# Altium project serdes-interface.PrjPcb
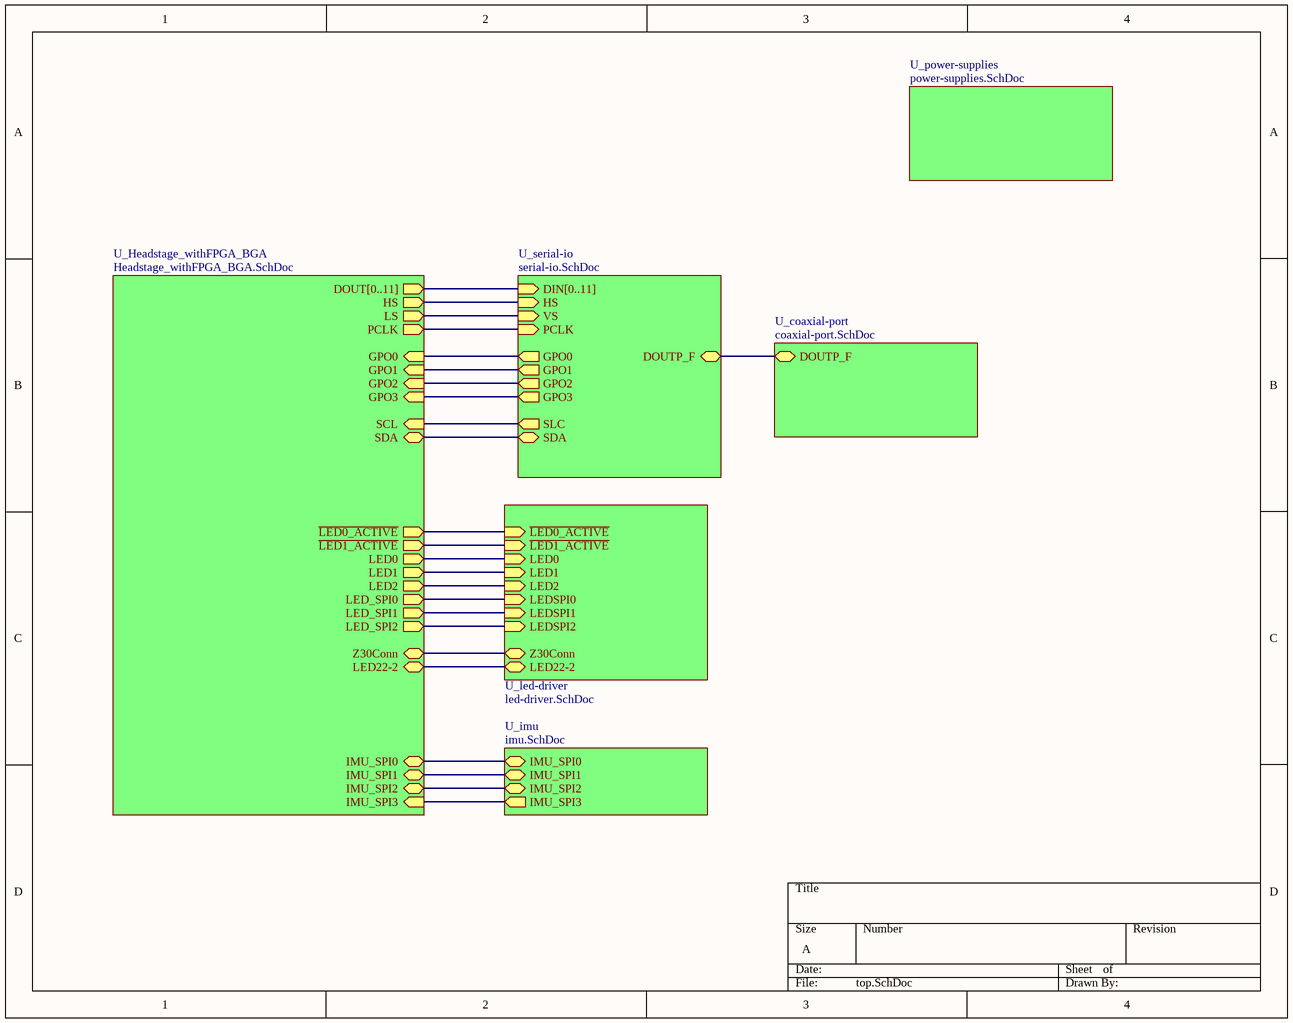
[diagram p0: top.SchDoc]
6 sheets, 71 parts. Net scope: hierarchical (ports join the sheet entries above them; power ports are global).
Board file: serdes-interface.PcbDoc
Sheets:
  top.SchDoc
    U_coaxial-port = coaxial-port.SchDoc
    U_power-supplies = power-supplies.SchDoc
    U_serial-io = serial-io.SchDoc
    U_led-driver = led-driver.SchDoc
    U_imu = imu.SchDoc

## Sheet top.SchDoc
size A

### Sub-sheets
U_coaxial-port = coaxial-port.SchDoc: DOUTP_F (bidir)
U_Headstage_withFPGA_BGA = Headstage_withFPGA_BGA.SchDoc (file not in this document): DOUT[0..11] (out), HS (out), LS (out), PCLK (out), GPO3 (in), GPO2 (in), GPO1 (in), SDA (bidir), SCL (in), GPO0 (in), ~{LED0_ACTIVE} (out), ~{LED1_ACTIVE} (out), LED0 (out), LED1 (out), LED2 (out), LED_SPI0 (out), LED_SPI1 (out), LED_SPI2 (out), Z30Conn (bidir), IMU_SPI0 (bidir), IMU_SPI1 (bidir), IMU_SPI2 (bidir), IMU_SPI3 (in), LED22-2
U_imu = imu.SchDoc: IMU_SPI0 (bidir), IMU_SPI1 (bidir), IMU_SPI2 (bidir), IMU_SPI3 (out)
U_led-driver = led-driver.SchDoc: ~{LED0_ACTIVE} (in), ~{LED1_ACTIVE} (in), LEDSPI0 (in), LED0 (in), LED1 (in), LED2 (in), LEDSPI1 (in), LEDSPI2 (in), Z30Conn (bidir), LED22-2
U_power-supplies = power-supplies.SchDoc: no entries
U_serial-io = serial-io.SchDoc: DIN[0..11] (in), HS (in), VS (in), PCLK (in), DOUTP_F (bidir), SDA (bidir), SLC (out), GPO0 (out), GPO1 (out), GPO2 (out), GPO3 (out)

### Nets
LED0: sheet U_Headstage_withFPGA_BGA/LED0, sheet U_led-driver/LED0
LED1: sheet U_Headstage_withFPGA_BGA/LED1, sheet U_led-driver/LED1
LED2: sheet U_Headstage_withFPGA_BGA/LED2, sheet U_led-driver/LED2
LED22-2: sheet U_Headstage_withFPGA_BGA/LED22-2, sheet U_led-driver/LED22-2
LEDSPI0: sheet U_Headstage_withFPGA_BGA/LED_SPI0, sheet U_led-driver/LEDSPI0
LEDSPI1: sheet U_Headstage_withFPGA_BGA/LED_SPI1, sheet U_led-driver/LEDSPI1
LEDSPI2: sheet U_Headstage_withFPGA_BGA/LED_SPI2, sheet U_led-driver/LEDSPI2
Z30Conn: sheet U_Headstage_withFPGA_BGA/Z30Conn, sheet U_led-driver/Z30Conn
NetC18#1_1: sheet U_coaxial-port/DOUTP_F, sheet U_serial-io/DOUTP_F
NetLD1_21: sheet U_Headstage_withFPGA_BGA/~{LED0_ACTIVE}, sheet U_led-driver/~{LED0_ACTIVE}
NetLD2_21: sheet U_Headstage_withFPGA_BGA/~{LED1_ACTIVE}, sheet U_led-driver/~{LED1_ACTIVE}
NetR7_1: sheet U_serial-io/SDA, sheet U_Headstage_withFPGA_BGA/SDA
NetR8_1: sheet U_serial-io/SLC, sheet U_Headstage_withFPGA_BGA/SCL
NetU9_1: sheet U_serial-io/HS, sheet U_Headstage_withFPGA_BGA/HS
NetU9_2: sheet U_serial-io/VS, sheet U_Headstage_withFPGA_BGA/LS
NetU9_3: sheet U_serial-io/PCLK, sheet U_Headstage_withFPGA_BGA/PCLK
NetU9_15: sheet U_serial-io/GPO0, sheet U_Headstage_withFPGA_BGA/GPO0
NetU9_16: sheet U_serial-io/GPO1, sheet U_Headstage_withFPGA_BGA/GPO1
NetU9_17: sheet U_serial-io/GPO2, sheet U_Headstage_withFPGA_BGA/GPO2
NetU9_18: sheet U_serial-io/GPO3, sheet U_Headstage_withFPGA_BGA/GPO3
(unnamed): sheet U_Headstage_withFPGA_BGA/IMU_SPI0, sheet U_imu/IMU_SPI0
(unnamed): sheet U_Headstage_withFPGA_BGA/IMU_SPI1, sheet U_imu/IMU_SPI1
(unnamed): sheet U_Headstage_withFPGA_BGA/IMU_SPI2, sheet U_imu/IMU_SPI2
(unnamed): sheet U_Headstage_withFPGA_BGA/IMU_SPI3, sheet U_imu/IMU_SPI3

### Buses and harness runs
bus sheet U_Headstage_withFPGA_BGA/DOUT[0..11] = sheet U_serial-io/DIN[0..11]

## Sheet coaxial-port.SchDoc
size A
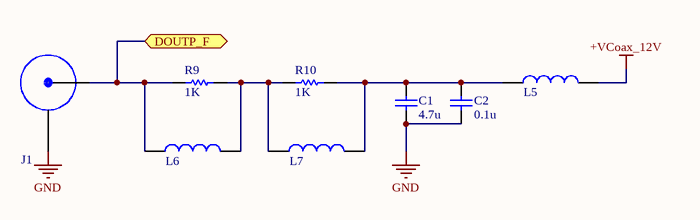
[diagram p1: coaxial-port.SchDoc]

### Parts
C1  value 4.7u  [Cap-0603]  (hidden comment: X7R Ceramic)
C2  value 0.1u  [Cap-0603]  (hidden comment: X7R Ceramic)
J1  Coax Connector  [SMA_132134-10-ND]  (value not drawn)
L5  Ferrite Bead  [BLM18KG601SN1D]  (value not drawn)
L6  Ferrite Bead  [CIG21L4R7MNE]  (value not drawn)
L7  Ferrite Bead  [CBC3225T101MR]  (value not drawn)
R9  value 1K  [Res_0402]  (hidden comment: Res1)
R10  value 1K  [Res_0402]  (hidden comment: Res1)

### Ports
DOUTP_F (bidir)

### Nets
+VCoax_12V: L5.2
GND: C1.1 C2.1 J1.1
NetC1_2: C1.2 C2.2 L5.1 L7.2 R10.1
NetC18#1_1: J1.0 L6.1 R9.2 ; port DOUTP_F
NetL6_2: L6.2 L7.1 R9.1 R10.2

### Library data of the parts
C1 C2 = Cap: Capacitor; Published: 8-Jun-2000; LatestRevisionDate: 17-Jul-2002; LatestRevisionNote: Re-released for DXP Platform.; PackageReference: RAD-0.3; Publisher: Altium Limited; PackageDescription: Radial Cap, Thru-Hole; 2 Leads; 0.3 in Pin Spacing
R9 R10 = Res1: Resistor; Published: 8-Jun-2000; LatestRevisionDate: 17-Jul-2002; LatestRevisionNote: Re-released for DXP Platform.; PackageReference: AXIAL-0.3; Publisher: Altium Limited; PackageDescription: Axial Device, Thru-Hole; 2 Leads; 0.3 in Pin Spacing

## Sheet power-supplies.SchDoc
size A
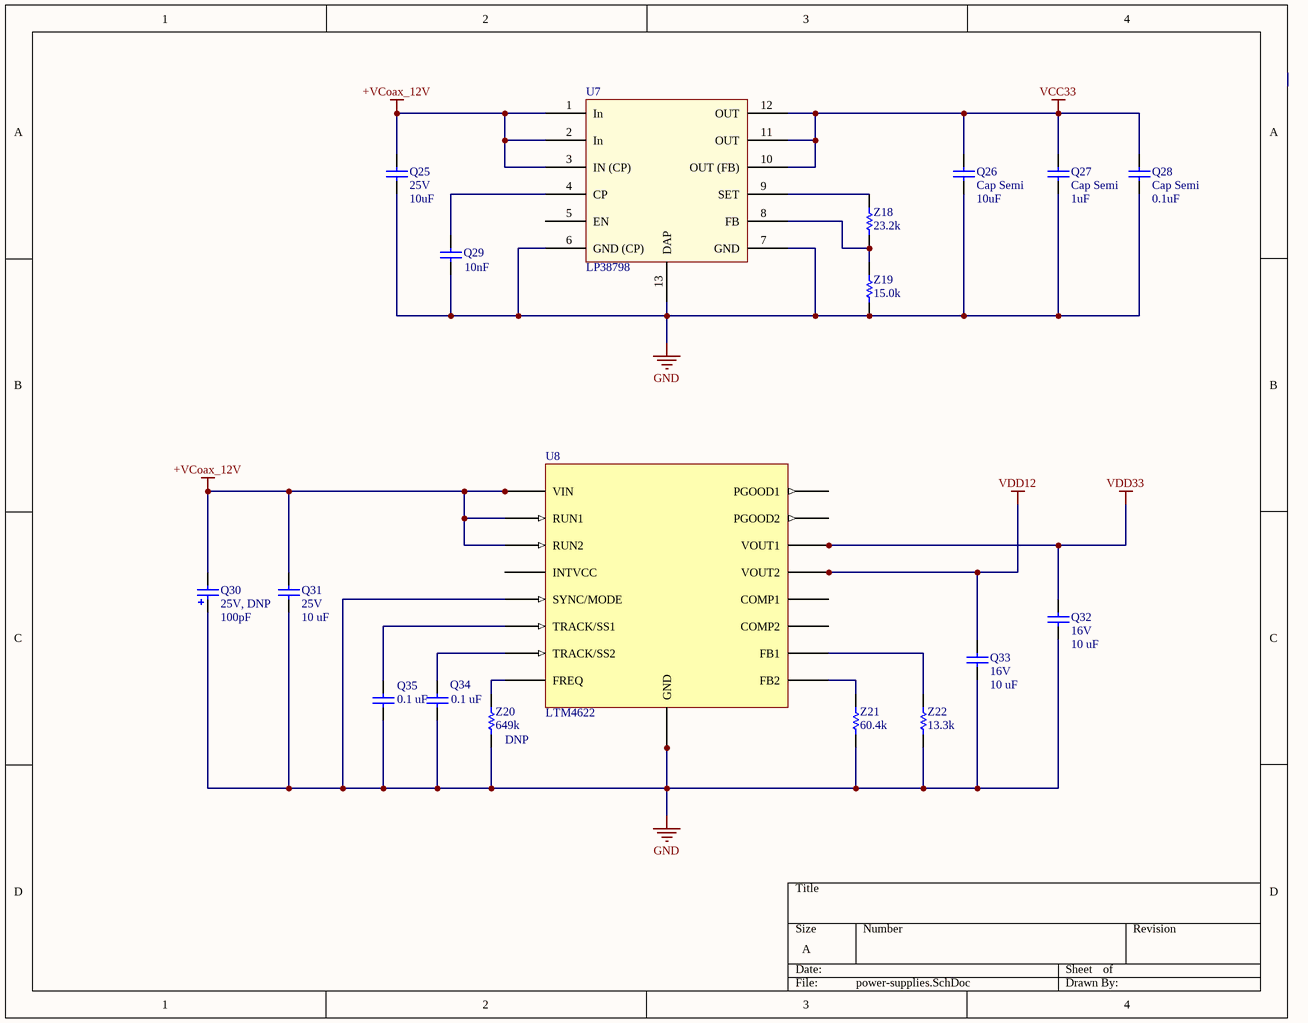
[diagram p2: power-supplies.SchDoc]

### Parts
Q25  25V  value 10uF  [C1206]
Q26  Cap Semi  value 10uF  [Cap-0603]
Q27  Cap Semi  value 1uF  [Cap-0603]
Q28  Cap Semi  value 0.1uF  [Cap-0603]
Q29  value 10nF  [0402]
Q30  25V, DNP  value 100pF  [C0805]
Q31  25V  value 10 uF  [C1206]
Q32  16V  value 10 uF  [C1206]
Q33  16V  value 10 uF  [C1206]
Q34  value 0.1 uF  [C1206]  (hidden comment: 25V)
Q35  value 0.1 uF  [C1206]  (hidden comment: 25V)
U7  LP38798  [DFN12]
U8  LTM4622  [LGA5x5]
Z18  value 23.2k  [Res_0402]  (hidden comment: Res1)
Z19  value 15.0k  [Res_0402]  (hidden comment: Res1)
Z20  DNP  value 649k  [Res_0402]
Z21  value 60.4k  [Res_0402]  (hidden comment: 649k (DNP))
Z22  value 13.3k  [Res_0402]

### Nets
+VCoax_12V: Q25.2 Q30.2 Q31.2 U7.1(In) U7.2(In) U7.3(IN_(CP)) U8.A2(VIN) U8.B2(RUN2) U8.B3(VIN) U8.D2(RUN1) U8.D3(VIN) U8.E2(VIN)
GND: Q25.1 Q26.1 Q27.1 Q28.1 Q29.1 Q30.1 Q31.1 Q32.1 Q33.1 Q34.1 Q35.1 U7.6(GND_(CP)) U7.7(GND) U7.13(DAP) U8.B5(GND) U8.C1(GND) U8.C2(GND) U8.C5(SYNC/MODE) U8.D5(GND) Z19.2 Z20.2 Z21.2 Z22.2
VCC33: Q26.2 Q27.2 Q28.2 U7.10(OUT_(FB)) U7.11(OUT) U7.12(OUT)
VDD12: Q33.2 U8.A1(VOUT2) U8.B1(VOUT2)
VDD33: Q32.2 U8.D1(VOUT1) U8.E1(VOUT1)
NetQ29_2: Q29.2 U7.4(CP)
NetQ34_2: Q34.2 U8.A3(TRACK/SS2)
NetQ35_2: Q35.2 U8.E5(TRACK/SS1)
NetU7_8: U7.8(FB) Z18.2 Z19.1
NetU7_9: U7.9(SET) Z18.1
NetU8_A4: U8.A4(FB2) Z21.1
NetU8_C4: U8.C4(FREQ) Z20.1
NetU8_E4: U8.E4(FB1) Z22.1

Not connected (* = marked no-connect by the designer): U7 5(EN); U8 A5(COMP2) B4(PGOOD2) C3(INTVCC) D4(PGOOD1)

### Library data of the parts
Q25-Q29 Q31-Q35 = Cap Semi: Capacitor (Semiconductor SIM Model); Published: 8-Jun-2000; LatestRevisionDate: 29-May-2009; LatestRevisionNote: IPC-7351 Footprint Added.; PackageReference: C1206; Publisher: Altium Limited; PackageDescription: Chip Capacitor
  Q31 Q34 Q35: Voltage: 25 V
  Q32 Q33: Voltage: 16 V
Q30 = Cap Pol3: Polarized Capacitor (Surface Mount); Published: 8-Jun-2000; LatestRevisionDate: 29-May-2009; LatestRevisionNote: IPC-7351 Footprint Added.; PackageReference: C0805; Publisher: Altium Limited; PackageDescription: Chip Capacitor
U7 = Component_1: Low Noise Positive LDO
Z18-Z22 = Res1: Resistor; Published: 8-Jun-2000; LatestRevisionDate: 17-Jul-2002; LatestRevisionNote: Re-released for DXP Platform.; PackageReference: AXIAL-0.3; Publisher: Altium Limited; PackageDescription: Axial Device, Thru-Hole; 2 Leads; 0.3 in Pin Spacing

## Sheet serial-io.SchDoc
size A
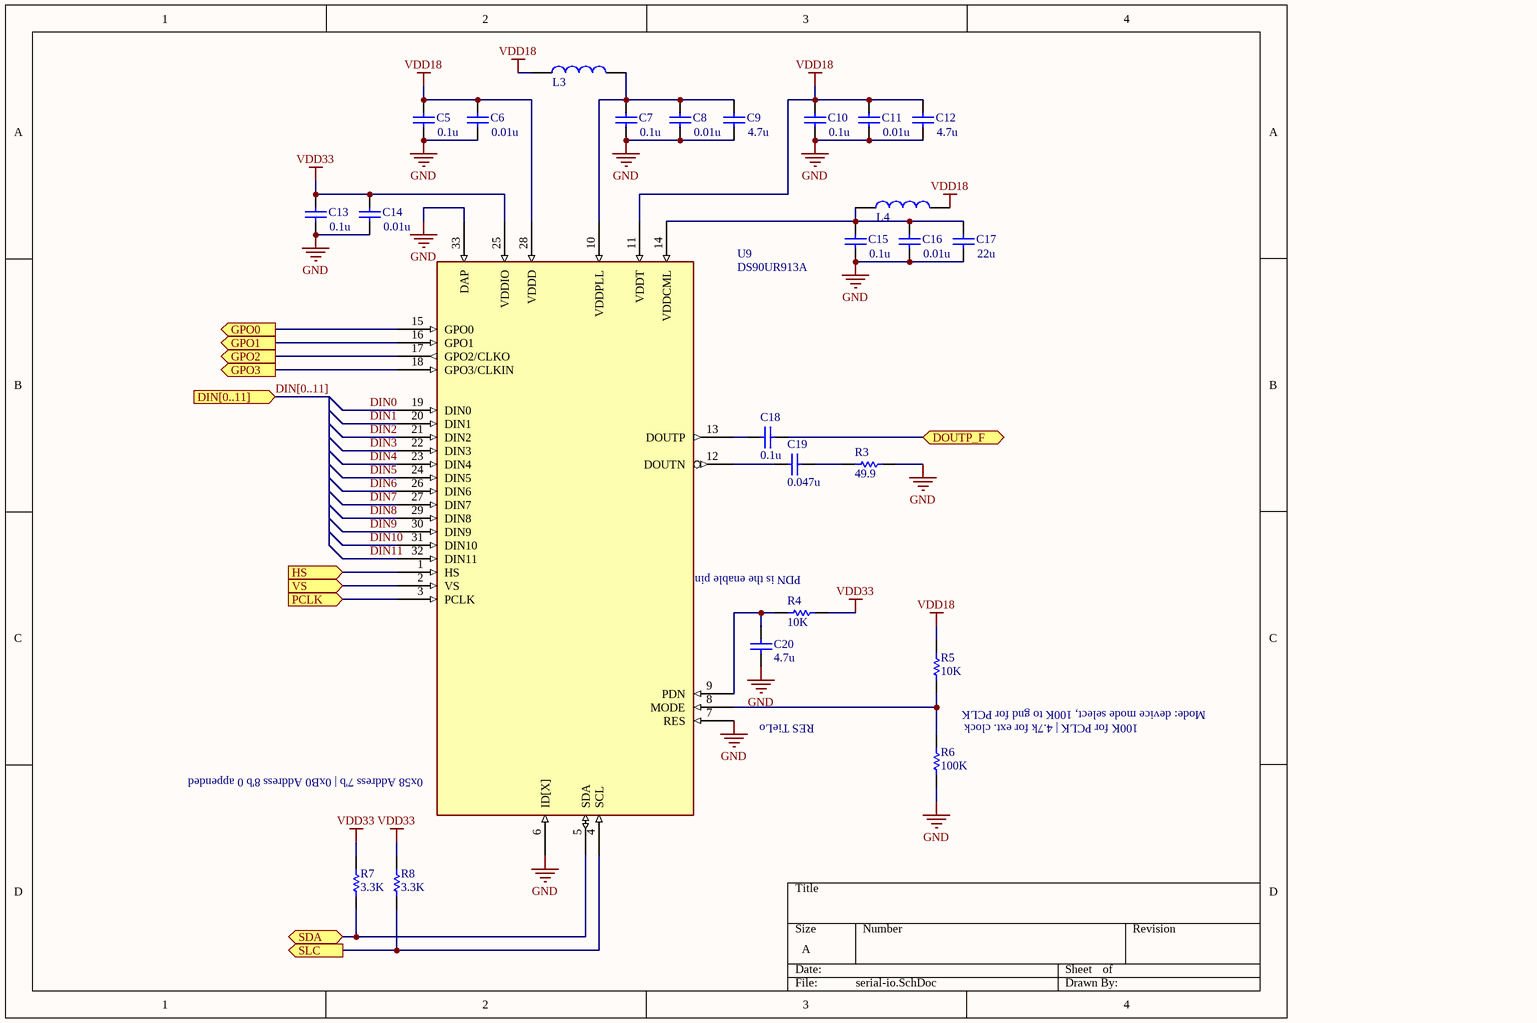
[diagram p3: serial-io.SchDoc]

### Parts
(Parts that share a designator on the sheet are numbered #1, #2 ... from top to bottom, then left to right.)
C5  value 0.1u  [Cap_0402]  (hidden comment: X7R Ceramic)
C6  value 0.01u  [Cap_0402]  (hidden comment: X7R Ceramic)
C7  value 0.1u  [Cap_0402]  (hidden comment: X7R Ceramic)
C8  value 0.01u  [Cap_0402]  (hidden comment: X7R Ceramic)
C9  value 4.7u  [Cap_0402]  (hidden comment: X7R Ceramic)
C10  value 0.1u  [Cap_0402]  (hidden comment: X7R Ceramic)
C11  value 0.01u  [Cap_0402]  (hidden comment: X7R Ceramic)
C12  value 4.7u  [Cap_0402]  (hidden comment: X7R Ceramic)
C13  value 0.1u  [Cap_0402]  (hidden comment: X7R Ceramic)
C14  value 0.01u  [Cap_0402]  (hidden comment: X7R Ceramic)
C15  value 0.1u  [Cap_0402]  (hidden comment: X7R Ceramic)
C16  value 0.01u  [Cap_0402]  (hidden comment: X7R Ceramic)
C17  value 22u  [Cap-0603]  (hidden comment: X7R Ceramic)
C18#1  value 0.1u  [Cap_0402]  (hidden comment: X7R Ceramic)
C19  value 0.047u  [Cap_0402]  (hidden comment: X7R Ceramic)
C20  value 4.7u  [Cap_0402]  (hidden comment: X7R Ceramic)
L3  Ferrite Bead  [BLM18KG601SN1D]  (value not drawn)
L4  Ferrite Bead  [BLM18KG601SN1D]  (value not drawn)
R3  value 49.9  [Res_0402]  (hidden comment: Res1)
R4  value 10K  [Res_0402]  (hidden comment: Res1)
R5  value 10K  [Res_0402]  (hidden comment: Res1)
R6  value 100K  [Res_0402]  (hidden comment: Res1)
R7  value 3.3K  [Res_0402]  (hidden comment: Res1)
R8  value 3.3K  [Res_0402]  (hidden comment: Res1)
U9  DS90UR913A  [WQFN32-DS90UB913A]

### Ports
DIN[0..11] (in), DOUTP_F (bidir), GPO0 (out), GPO1 (out), GPO2 (out), GPO3 (out), HS (in), PCLK (in), SDA (bidir), SLC (out), VS (in)

### Nets
GND: C5.1 C6.1 C7.1 C8.1 C9.1 C10.1 C11.1 C12.1 C13.1 C14.1 C15.1 C16.1 C17.1 C20.1 R3.2 R6.1 U9.6(ID[X]) U9.7(RES) U9.33(DAP)
VDD18: C5.2 C6.2 C10.2 C11.2 C12.2 L3.1 L4.2 R5.2 U9.11(VDDT) U9.28(VDDD)
VDD33: C13.2 C14.2 R4.2 R7.2 R8.2 U9.25(VDDIO)
DIN0: U9.19(DIN0)
DIN1: U9.20(DIN1)
DIN2: U9.21(DIN2)
DIN3: U9.22(DIN3)
DIN4: U9.23(DIN4)
DIN5: U9.24(DIN5)
DIN6: U9.26(DIN6)
DIN7: U9.27(DIN7)
DIN8: U9.29(DIN8)
DIN9: U9.30(DIN9)
DIN10: U9.31(DIN10)
DIN11: U9.32(DIN11)
NetC7_2: C7.2 C8.2 C9.2 L3.2 U9.10(VDDPLL)
NetC15_2: C15.2 C16.2 C17.2 L4.1 U9.14(VDDCML)
NetC18#1_1: C18#1.1 ; port DOUTP_F
NetC18#1_2: C18#1.2 U9.13(DOUTP)
NetC19_1: C19.1 R3.1
NetC19_2: C19.2 U9.12(DOUTN)
NetC20_2: C20.2 R4.1 U9.9(PDN)
NetR5_1: R5.1 R6.2 U9.8(MODE)
NetR7_1: R7.1 U9.5(SDA) ; port SDA
NetR8_1: R8.1 U9.4(SCL) ; port SLC
NetU9_1: U9.1(HS) ; port HS
NetU9_2: U9.2(VS) ; port VS
NetU9_3: U9.3(PCLK) ; port PCLK
NetU9_15: U9.15(GPO0) ; port GPO0
NetU9_16: U9.16(GPO1) ; port GPO1
NetU9_17: U9.17(GPO2/CLKO) ; port GPO2
NetU9_18: U9.18(GPO3/CLKIN) ; port GPO3

### Buses and harness runs
bus DIN[0..11] = port DIN[0..11]

### Notes on the sheet
- (near U9) PDN is the enable pin
- Mode: device mode select, 100K to gnd for PCLK
- (near U9) 0x58 Address 7'b | 0xB0 Address 8'b 0 appended
- RES TieLo
- (near R6) 100K for PCLK | 4.7k for ext. clock

### Library data of the parts
C5-C17 C18#1 C19 C20 = Cap: Capacitor; Published: 8-Jun-2000; LatestRevisionDate: 17-Jul-2002; LatestRevisionNote: Re-released for DXP Platform.; PackageReference: RAD-0.3; Publisher: Altium Limited; PackageDescription: Radial Cap, Thru-Hole; 2 Leads; 0.3 in Pin Spacing
R3-R8 = Res1: Resistor; Published: 8-Jun-2000; LatestRevisionDate: 17-Jul-2002; LatestRevisionNote: Re-released for DXP Platform.; PackageReference: AXIAL-0.3; Publisher: Altium Limited; PackageDescription: Axial Device, Thru-Hole; 2 Leads; 0.3 in Pin Spacing
U9 = DS90UR913A: DS90UR913ASERIALIZER

## Sheet led-driver.SchDoc
size A
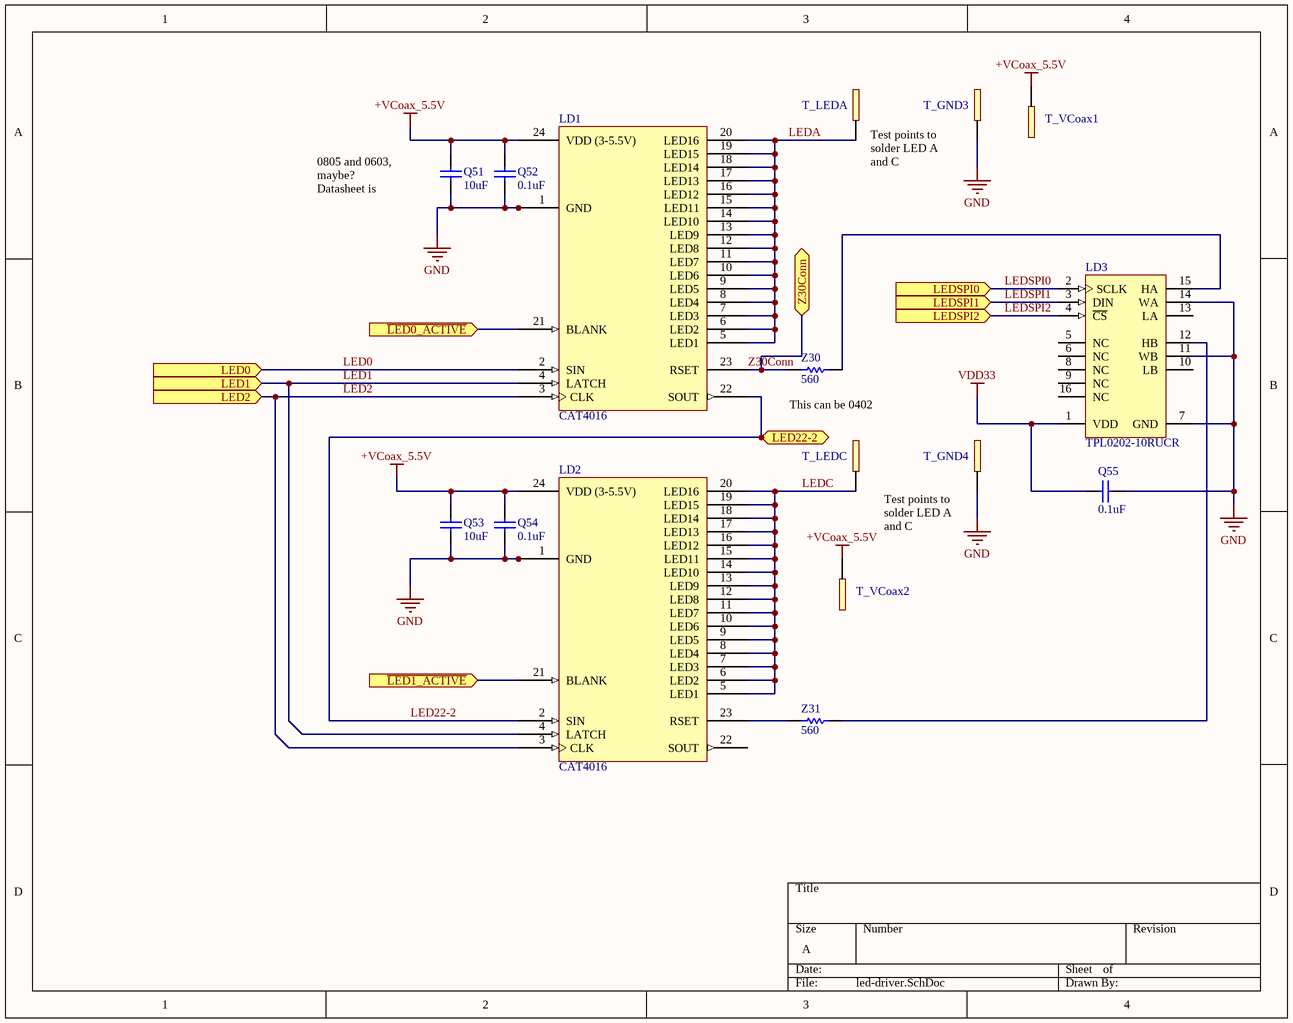
[diagram p4: led-driver.SchDoc]

### Parts
LD1  CAT4016  [TQFN24-4x4mm]
LD2  CAT4016  [TQFN24-4x4mm]
LD3  TPL0202-10RUCR  [WQFN16-3X3mm]
Q51  value 10uF  [Cap-0603]  (hidden comment: Cap)
Q52  value 0.1uF  [Cap_0402]  (hidden comment: Cap)
Q53  value 10uF  [Cap-0603]  (hidden comment: Cap)
Q54  value 0.1uF  [Cap_0402]  (hidden comment: Cap)
Q55  value 0.1uF  [Cap_0402]  (hidden comment: Cap)
T_GND3  Header_1PIN  [JUMPER1PIN]  (value not drawn)
T_GND4  Header_1PIN  [JUMPER1PIN]  (value not drawn)
T_LEDA  Header_1PIN  [JUMPER1PIN]  (value not drawn)
T_LEDC  Header_1PIN  [JUMPER1PIN]  (value not drawn)
T_VCoax1  Header_1PIN  [JUMPER1PIN]  (value not drawn)
T_VCoax2  Header_1PIN  [JUMPER1PIN]  (value not drawn)
Z30  value 560  [Res_0402]  (hidden comment: Res1)
Z31  value 560  [Res_0402]  (hidden comment: Res1)

### Ports
LED0 (in), LED1 (in), LED2 (in), LED22-2, LEDSPI0 (in), LEDSPI1 (in), LEDSPI2 (in), Z30Conn (bidir), ~{LED0_ACTIVE} (in), ~{LED1_ACTIVE} (in)

### Nets
+VCoax_5.5V: LD1.24(VDD_(3-5.5V)) LD2.24(VDD_(3-5.5V)) Q51.2 Q52.2 Q53.2 Q54.2 T_VCoax1.0 T_VCoax2.0
GND: LD1.1(GND) LD1.PAD LD2.1(GND) LD2.PAD LD3.7(GND) LD3.11(WB) LD3.14(WA) Q51.1 Q52.1 Q53.1 Q54.1 Q55.2 T_GND3.0 T_GND4.0
VDD33: LD3.1(VDD) Q55.1
LED0: LD1.2(SIN) ; port LED0
LED1: LD1.4(LATCH) LD2.4(LATCH) ; port LED1
LED2: LD1.3(CLK) LD2.3(CLK) ; port LED2
LED22-2: LD1.22(SOUT) LD2.2(SIN) ; port LED22-2
LEDA: LD1.5(LED1) LD1.6(LED2) LD1.7(LED3) LD1.8(LED4) LD1.9(LED5) LD1.10(LED6) LD1.11(LED7) LD1.12(LED8) LD1.13(LED9) LD1.14(LED10) LD1.15(LED11) LD1.16(LED12) LD1.17(LED13) LD1.18(LED14) LD1.19(LED15) LD1.20(LED16) T_LEDA.0
LEDC: LD2.5(LED1) LD2.6(LED2) LD2.7(LED3) LD2.8(LED4) LD2.9(LED5) LD2.10(LED6) LD2.11(LED7) LD2.12(LED8) LD2.13(LED9) LD2.14(LED10) LD2.15(LED11) LD2.16(LED12) LD2.17(LED13) LD2.18(LED14) LD2.19(LED15) LD2.20(LED16) T_LEDC.0
LEDSPI0: LD3.2(SCLK) ; port LEDSPI0
LEDSPI1: LD3.3(DIN) ; port LEDSPI1
LEDSPI2: LD3.4(~{CS}) ; port LEDSPI2
Z30Conn: LD1.23(RSET) Z30.2 ; port Z30Conn
NetLD1_21: LD1.21(BLANK) ; port ~{LED0_ACTIVE}
NetLD2_21: LD2.21(BLANK) ; port ~{LED1_ACTIVE}
NetLD2_23: LD2.23(RSET) Z31.2
NetLD3_12: LD3.12(HB) Z31.1
NetLD3_15: LD3.15(HA) Z30.1

Not connected (* = marked no-connect by the designer): LD2 22(SOUT); LD3 5(NC) 6(NC) 8(NC) 9(NC) 10(LB) 13(LA) 16(NC)

### Notes on the sheet
- Test points to solder LED A and C
- (near Q51) 0805 and 0603, maybe? Datasheet is lacking...
- (near Z30) This can be 0402

### Library data of the parts
LD1 LD2 = CAT4016: 16-Channel Constant Current LED Driver
LD3 = TPL0202-10RUCR: 256 Tap, Dual Channel Digital Potentiometer with SPI Interface and Non-Volatile Memory, -40 to 85 degC, 14-pin QFN (RUC14); Manufacturer: Texas Instruments; DAC Channels: 2; DNL(Max)(+/-LSB): 0.5; INL(Max)(+/-LSB): 1; DatasheetVersion: SLIS135C; PackageVersion: 4208447/C, 08/2008; PackageReference: RUC14; PackageDescription: 14-Pin Plastic Quad Flatpack No-Lead, Body 2 x 2 mm, Pitch 0.4 mm; Supplier 1: Mouser; Supplier Part Number 1: N/A; Interface: SPI; SubFamily: Digital Potentiometer; Mounting Technology: Surface Mount; Code_JEDEC: MO-288; PartNumber: TPL0202-10RUCR; ComponentLink1Description: Manufacturer URL; ComponentLink1URL: http://www.ti.com/; ComponentLink2Description: Datasheet; ComponentLink2URL: http://www.ti.com/general/docs/lit/getliterature.tsp?genericPartNumber=TPL0202-10&fileType=pdf; ComponentLink3Description: Package Specification; ComponentLink3URL: http://www.ti.com/lit/ml/mpqf212b/mpqf212b.pdf
Q51-Q55 = Cap: Capacitor; Published: 8-Jun-2000; LatestRevisionDate: 17-Jul-2002; LatestRevisionNote: Re-released for DXP Platform.; PackageReference: RAD-0.3; Publisher: Altium Limited; PackageDescription: Radial Cap, Thru-Hole; 2 Leads; 0.3 in Pin Spacing
Z30 Z31 = Res1: Resistor; Published: 8-Jun-2000; LatestRevisionDate: 17-Jul-2002; LatestRevisionNote: Re-released for DXP Platform.; PackageReference: AXIAL-0.3; Publisher: Altium Limited; PackageDescription: Axial Device, Thru-Hole; 2 Leads; 0.3 in Pin Spacing

## Sheet imu.SchDoc
size A
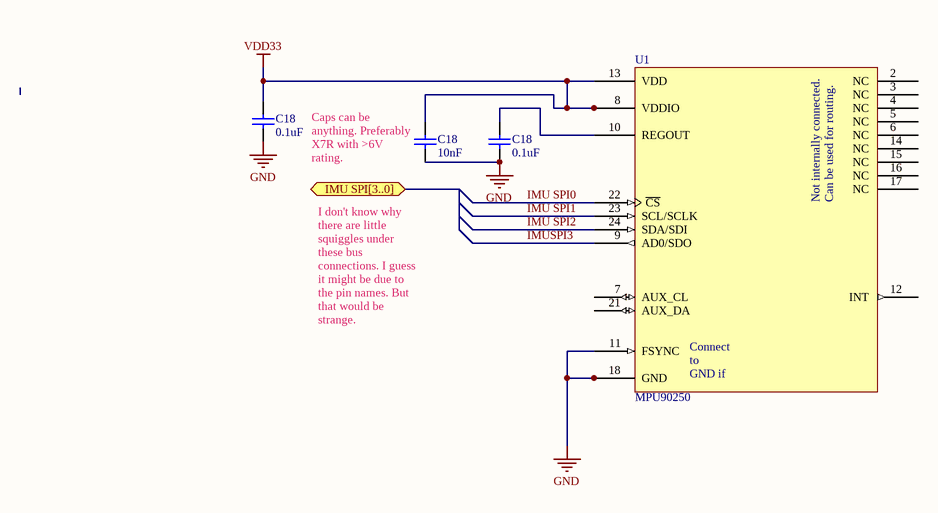
[diagram p5: imu.SchDoc]

### Parts
(Parts that share a designator on the sheet are numbered #1, #2 ... from top to bottom, then left to right.)
C18#2  value 0.1uF  [RAD-0.3]  (hidden comment: Cap)
C18#3  value 10nF  [RAD-0.3]  (hidden comment: Cap)
C18#4  value 0.1uF  [RAD-0.3]  (hidden comment: Cap)
U1  MPU90250  [QFN24-3x3mm]

### Ports
IMU SPI[3..0] (bidir)

### Nets
GND: C18#2.2 C18#3.2 C18#4.2 U1.11(FSYNC) U1.18(GND) U1.20(RESV)
VDD33: C18#2.1 C18#3.1 U1.1(RESV) U1.8(VDDIO) U1.13(VDD)
IMU SPI0: U1.22(~{CS})
IMU SPI1: U1.23(SCL/SCLK)
IMU SPI2: U1.24(SDA/SDI)
IMUSPI3: U1.9(AD0/SDO)
NetC18#4_1: C18#4.1 U1.10(REGOUT)

Not connected (* = marked no-connect by the designer): U1 2(NC) 3(NC) 4(NC) 5(NC) 6(NC) 7(AUX_CL) 12(INT) 14(NC) 15(NC) 16(NC) 17(NC) 19(DO_NOT_CONNECT) 21(AUX_DA)

### Notes on the sheet
- (near C18#3) Caps can be anything. Preferably X7R with >6V rating.
- I don't know why there are little squiggles under these bus connections. I guess it might be due to the pin names. But that would be strange.
- (in symbol MPU90250) Not internally connected.; Can be used for routing.; Connect to / GND if / not in use

### Library data of the parts
C18#2-C18#4 = Cap: Capacitor; Published: 8-Jun-2000; LatestRevisionDate: 17-Jul-2002; LatestRevisionNote: Re-released for DXP Platform.; PackageReference: RAD-0.3; Publisher: Altium Limited; PackageDescription: Radial Cap, Thru-Hole; 2 Leads; 0.3 in Pin Spacing
U1 = MPU90250: 9-Axis IMU (Accel, Gyro, Magno)

## Nets that join several sheets
+VCoax_12V: coaxial-port (L5.2), power-supplies (12 pins)
GND: coaxial-port (C1.1 C2.1 J1.1), power-supplies (23 pins), serial-io (19 pins), led-driver (14 pins), imu (6 pins)
VDD33: power-supplies (Q32.2 U8.D1 U8.E1), serial-io (6 pins), led-driver (LD3.1 Q55.1), imu (5 pins)
NetC18#1_1: coaxial-port (J1.0 L6.1 R9.2), serial-io (C18#1.1)